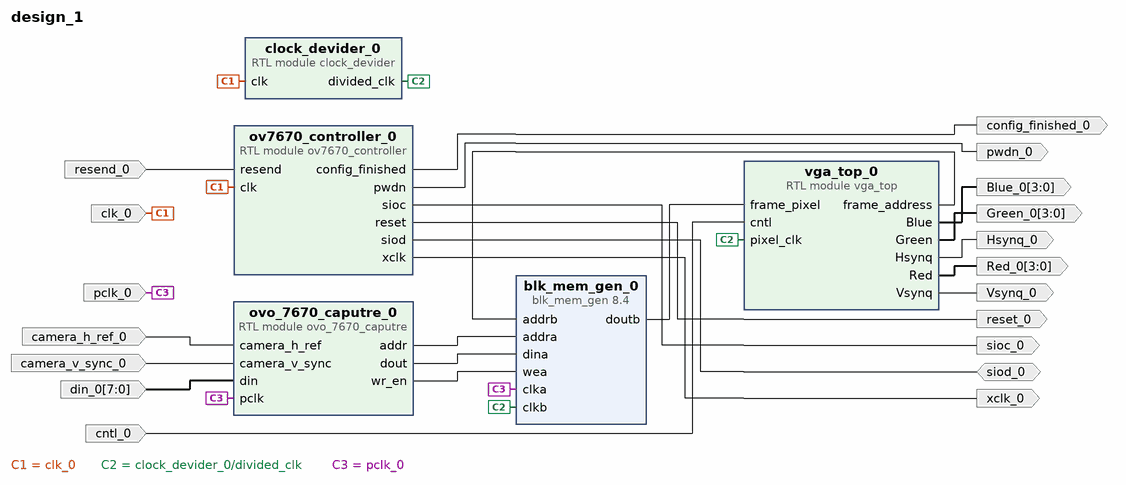
[diagram p0: block diagram of the top level]
# Vivado block design design_1, xc7a100tcsg324-1, Vivado 2019.2
create_bd_design design_1

create_bd_port -dir I -type clk clk_0
create_bd_port -dir I cntl_0
create_bd_port -dir O -from 3 -to 0 Blue_0
create_bd_port -dir O -from 3 -to 0 Green_0
create_bd_port -dir O Hsynq_0
create_bd_port -dir O -from 3 -to 0 Red_0
create_bd_port -dir O Vsynq_0
create_bd_port -dir I camera_h_ref_0
create_bd_port -dir I camera_v_sync_0
create_bd_port -dir I pclk_0
create_bd_port -dir I -from 7 -to 0 din_0
create_bd_port -dir O config_finished_0
create_bd_port -dir O sioc_0
create_bd_port -dir O -type rst reset_0
create_bd_port -dir IO siod_0
create_bd_port -dir O pwdn_0
create_bd_port -dir O xclk_0
create_bd_port -dir I resend_0

create_bd_cell -type module -reference clock_devider clock_devider_0
create_bd_cell -type ip -vlnv xilinx.com:ip:blk_mem_gen:8.4 blk_mem_gen_0
set_property -dict [list \
  CONFIG.Enable_32bit_Address false \
  CONFIG.Enable_A Always_Enabled \
  CONFIG.Enable_B Always_Enabled \
  CONFIG.Memory_Type Simple_Dual_Port_RAM \
  CONFIG.Operating_Mode_A NO_CHANGE \
  CONFIG.Port_B_Clock 100 \
  CONFIG.Port_B_Enable_Rate 100 \
  CONFIG.Read_Width_B 12 \
  CONFIG.Register_PortB_Output_of_Memory_Primitives false \
  CONFIG.Use_Byte_Write_Enable false \
  CONFIG.Write_Depth_A 307200 \
  CONFIG.Write_Width_A 12 \
  CONFIG.Write_Width_B 12 \
  CONFIG.use_bram_block Stand_Alone \
] [get_bd_cells blk_mem_gen_0]
create_bd_cell -type module -reference vga_top vga_top_0
create_bd_cell -type module -reference ov7670_controller ov7670_controller_0
create_bd_cell -type module -reference ovo_7670_caputre ovo_7670_caputre_0

# ---- connections ----

connect_bd_net -net clk_0_1 [get_bd_ports clk_0] [get_bd_pins clock_devider_0/clk] [get_bd_pins ov7670_controller_0/clk]
connect_bd_net [get_bd_pins clock_devider_0/divided_clk] [get_bd_pins blk_mem_gen_0/clkb] [get_bd_pins vga_top_0/pixel_clk]
connect_bd_net -net cntl_0_1 [get_bd_ports cntl_0] [get_bd_pins vga_top_0/cntl]
connect_bd_net [get_bd_pins vga_top_0/Blue] [get_bd_ports Blue_0]
connect_bd_net [get_bd_pins vga_top_0/Green] [get_bd_ports Green_0]
connect_bd_net [get_bd_pins vga_top_0/Hsynq] [get_bd_ports Hsynq_0]
connect_bd_net [get_bd_pins vga_top_0/Red] [get_bd_ports Red_0]
connect_bd_net [get_bd_pins vga_top_0/Vsynq] [get_bd_ports Vsynq_0]
connect_bd_net [get_bd_pins blk_mem_gen_0/doutb] [get_bd_pins vga_top_0/frame_pixel]
connect_bd_net [get_bd_pins vga_top_0/frame_address] [get_bd_pins blk_mem_gen_0/addrb]
connect_bd_net -net camera_h_ref_0_1 [get_bd_ports camera_h_ref_0] [get_bd_pins ovo_7670_caputre_0/camera_h_ref]
connect_bd_net -net camera_v_sync_0_1 [get_bd_ports camera_v_sync_0] [get_bd_pins ovo_7670_caputre_0/camera_v_sync]
connect_bd_net -net pclk_0_1 [get_bd_ports pclk_0] [get_bd_pins ovo_7670_caputre_0/pclk] [get_bd_pins blk_mem_gen_0/clka]
connect_bd_net -net din_0_1 [get_bd_ports din_0] [get_bd_pins ovo_7670_caputre_0/din]
connect_bd_net [get_bd_pins ovo_7670_caputre_0/addr] [get_bd_pins blk_mem_gen_0/addra]
connect_bd_net [get_bd_pins ovo_7670_caputre_0/dout] [get_bd_pins blk_mem_gen_0/dina]
connect_bd_net [get_bd_pins ovo_7670_caputre_0/wr_en] [get_bd_pins blk_mem_gen_0/wea]
connect_bd_net [get_bd_pins ov7670_controller_0/config_finished] [get_bd_ports config_finished_0]
connect_bd_net [get_bd_pins ov7670_controller_0/sioc] [get_bd_ports sioc_0]
connect_bd_net [get_bd_pins ov7670_controller_0/reset] [get_bd_ports reset_0]
connect_bd_net [get_bd_ports siod_0] [get_bd_pins ov7670_controller_0/siod]
connect_bd_net [get_bd_pins ov7670_controller_0/pwdn] [get_bd_ports pwdn_0]
connect_bd_net [get_bd_pins ov7670_controller_0/xclk] [get_bd_ports xclk_0]
connect_bd_net -net resend_0_1 [get_bd_ports resend_0] [get_bd_pins ov7670_controller_0/resend]

validate_bd_design
save_bd_design
